# Altium project GoldFinger.PrjPcb
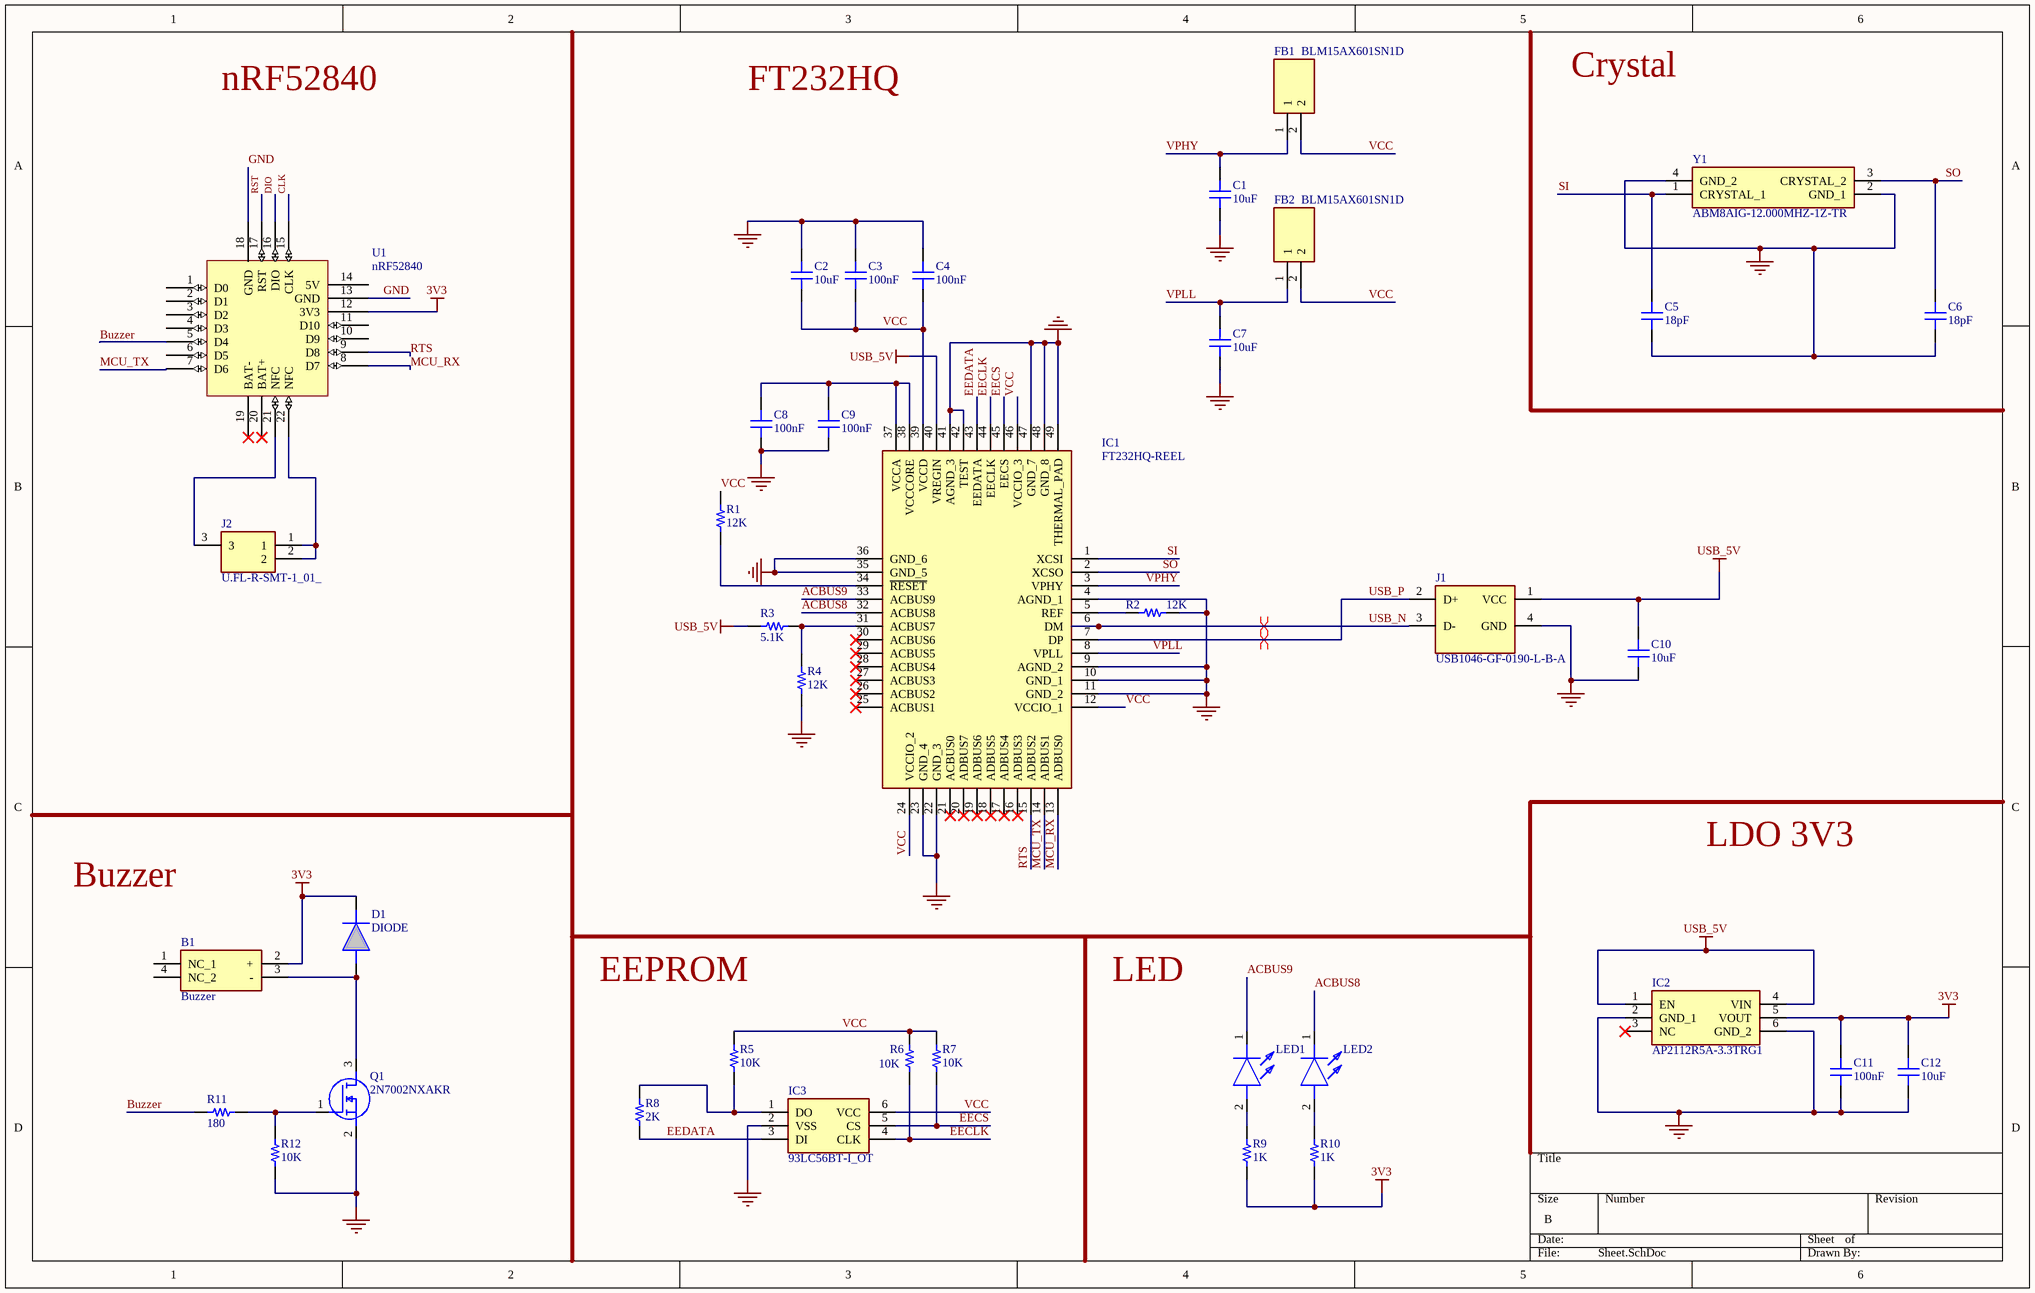
[diagram p0: Sheet.SchDoc]
1 sheet, 38 parts. Net scope: global (net labels, ports and power ports of the same name join across sheets).
Board file: Main.PcbDoc

## Sheet Sheet.SchDoc
size B; SheetNumber: 1; SheetTotal: 1

### Parts
B1  Buzzer  [CMT8530SSMTTR]
C1  10uF  [CAP 0402_1005]
C2  10uF  [CAP 0402_1005]
C3  100nF  [CAP 0402_1005]
C4  100nF  [CAP 0402_1005]
C5  18pF  [CAP 0402_1005]
C6  18pF  [CAP 0402_1005]
C7  10uF  [CAP 0402_1005]
C8  100nF  [CAP 0402_1005]
C9  100nF  [CAP 0402_1005]
C10  10uF  [CAP 0402_1005]
C11  100nF  [CAP 0402_1005]
C12  10uF  [CAP 0402_1005]
D1  DIODE  [SODFL1608X65N]
FB1  BLM15AX601SN1D  [NFZ15SG152SN10B]
FB2  BLM15AX601SN1D  [NFZ15SG152SN10B]
IC1  FT232HQ-REEL  [QFN50P800X800X100-49N-D]
IC2  AP2112R5A-3.3TRG1  [AP2112R5A33TRG1]
IC3  93LC56BT-I_OT  [SOT95P270X145-6N]
J1  USB1046-GF-0190-L-B-A  [USB1046GF0190LBA]
J2  U.FL-R-SMT-1_01_  [U.FL-R-SMT(01)]
LED1  150040VS73240  [LEDC1005X50N]  (value not drawn)
LED2  LW_QH8G-Q2OO-3K5L-1  [LEDC1005X40N]  (value not drawn)
Q1  2N7002NXAKR  [SOT95P230X110-3N]
R1  12K  [RES 0402_1005]
R2  12K  [RES 0402_1005]
R3  5.1K  [RES 0402_1005]
R4  12K  [RES 0402_1005]
R5  10K  [RES 0402_1005]
R6  10K  [RES 0402_1005]
R7  10K  [RES 0402_1005]
R8  2K  [RES 0402_1005]
R9  1K  [RES 0402_1005]
R10  1K  [RES 0402_1005]
R11  180  [RES 0402_1005]
R12  10K  [RES 0402_1005]
U1  nRF52840  [XIAO_nRF52840]
Y1  ABM8AIG-12.000MHZ-1Z-TR  [ABM8AIG12000MHZ1ZTR]

### Nets
3V3: B1.2(+) C11.2 C12.2 D1.1(K) IC2.5(VOUT) R9.1 R10.1 U1.12(3V3)
GND: C1.1 C2.2 C3.2 C4.2 C5.1 C6.1 C7.1 C8.1 C9.1 C10.1 C11.1 C12.1 IC1.4(AGND_1) IC1.9(AGND_2) IC1.10(GND_1) IC1.11(GND_2) IC1.22(GND_3) IC1.23(GND_4) IC1.35(GND_5) IC1.36(GND_6) IC1.41(AGND_3) IC1.42(TEST) IC1.47(GND_7) IC1.48(GND_8) IC1.49(THERMAL_PAD) IC2.2(GND_1) IC2.6(GND_2) IC3.2(VSS) J1.4(GND) Q1.2(S) R2.1 R4.1 R12.1 U1.13(GND) U1.18(GND) Y1.2(GND_1) Y1.4(GND_2)
USB_5V: C10.2 IC1.40(VREGIN) IC2.1(EN) IC2.4(VIN) J1.1(VCC) R3.2
ACBUS8: IC1.32(ACBUS8) LED2.1(K)
ACBUS9: IC1.33(ACBUS9) LED1.1(K)
Buzzer: R11.2 U1.5(D4)
CLK: U1.15(CLK)
DIO: U1.16(DIO)
EECLK: IC1.44(EECLK) IC3.4(CLK) R6.1
EECS: IC1.45(EECS) IC3.5(CS) R7.1
EEDATA: IC1.43(EEDATA) IC3.3(DI) R8.1
MCU_RX: IC1.13(ADBUS0) U1.8(D7)
MCU_TX: IC1.14(ADBUS1) U1.7(D6)
RST: U1.17(RST)
RTS: IC1.15(ADBUS2) U1.9(D8)
SI: C5.2 IC1.1(XCSI) Y1.1(CRYSTAL_1)
SO: C6.2 IC1.2(XCSO) Y1.3(CRYSTAL_2)
USB_N: IC1.6(DM) J1.3(D-)
USB_P: IC1.7(DP) J1.2(D+)
VCC: C2.1 C3.1 C4.1 FB1.2 FB2.2 IC1.12(VCCIO_1) IC1.24(VCCIO_2) IC1.39(VCCD) IC1.46(VCCIO_3) IC3.6(VCC) R1.2 R5.2 R6.2 R7.2
VPHY: C1.2 FB1.1 IC1.3(VPHY)
VPLL: C7.2 FB2.1 IC1.8(VPLL)
NetB1_3: B1.3(-) D1.2(A) Q1.3(D)
NetC8_2: C8.2 C9.2 IC1.37(VCCA) IC1.38(VCCCORE)
NetIC1_5: IC1.5(REF) R2.2
NetIC1_31: IC1.31(ACBUS7) R3.1 R4.2
NetIC1_34: IC1.34(~{RESET}) R1.1
NetIC3_1: IC3.1(DO) R5.1 R8.2
NetJ2_1: J2.1 J2.2 U1.22(NFC)
NetJ2_3: J2.3 U1.21(NFC)
NetLED1_2: LED1.2(A) R9.2
NetLED2_2: LED2.2(A) R10.2
NetQ1_1: Q1.1(G) R11.1 R12.2

Not connected (* = marked no-connect by the designer): B1 1(NC_1) 4(NC_2); IC1 16(ADBUS3)* 17(ADBUS4)* 18(ADBUS5)* 19(ADBUS6)* 20(ADBUS7)* 21(ACBUS0)* 25(ACBUS1)* 26(ACBUS2)* 27(ACBUS3)* 28(ACBUS4)* 29(ACBUS5)* 30(ACBUS6)*; IC2 3(NC)*; U1 1(D0) 2(D1) 3(D2) 4(D3) 6(D5) 10(D9) 11(D10) 14(5V) 19(BAT-)* 20(BAT+)*

### Layout directives
differential pair: USB_N, USB_P

### Notes on the sheet
- nRF52840
- FT232HQ
- Crystal
- Buzzer
- LDO 3V3
- EEPROM
- LED

### Library data of the parts
B1 = CMT-8530S-SMT-TR: Speakers & Transducers Buzzer 8.5mm sq 2.73kHz 3.6V SMT; Manufacturer_Name: CUI Devices; Geometry.Height: 3mm; Mouser Part Number: 490-CMT-8530S-SMT-TR; Mouser Price/Stock: https://www.mouser.co.uk/ProductDetail/CUI-Devices/CMT-8530S-SMT-TR/?qs=qCxwlXJ4fnxl6A4lXsnRBQ%3D%3D; Manufacturer_Part_Number: CMT-8530S-SMT-TR; Datasheet Link: https://datasheet.datasheetarchive.com/originals/distributors/DKDS-12/236652.pdf
C1 C2 C7 C10 C12 = Cap 0402: Multilayer Ceramic Capacitors MLCC - SMD/SMT NEW GLOBAL PN KGM05CR51A106MH 10V 10uF X5R 0402 2mm Pitch 20%; VALUE: 10uF; ComponentLink1Description: New link; ComponentLink1URL: https://eu.mouser.com/ProductDetail/KYOCERA-AVX/CM05X5R106M10AH?qs=MyNHzdoqoQKSCgSEDR5Ylg%3D%3D
C3 C4 C8 C9 C11 = Cap 0402: Multilayer Ceramic Capacitors MLCC - SMD/SMT 0402 16VDC 100nF 10% X7R; VALUE: 100nF; ComponentLink1Description: New link; ComponentLink1URL: https://eu.mouser.com/ProductDetail/TDK/C1005X7R1C104K050BC?qs=NRhsANhppD%252BhAGOapA8QKQ%3D%3D
C5 C6 = Cap 0402: Multilayer Ceramic Capacitors MLCC - SMD/SMT 16V 18pF X8R 0402 2% AEC-Q200; VALUE: 18pF; ComponentLink1Description: New link; ComponentLink1URL: https://eu.mouser.com/ProductDetail/KEMET/C0402C180G4HACAUTO?qs=j%252B1pi9TdxUYvGKJw1Hletg%3D%3D
D1 = BAS716_115: Rectifiers DIODE LOW LEAKAGE TAPE-7; Manufacturer_Name: Nexperia; Manufacturer_Part_Number: BAS716,115; Geometry.Height: 0.65mm; Mouser Part Number: 771-BAS716-T/R; Mouser Price/Stock: https://www.mouser.co.uk/ProductDetail/Nexperia/BAS716115?qs=me8TqzrmIYUJEW4Ty445kw%3D%3D; Datasheet Link: https://assets.nexperia.com/documents/data-sheet/BAS716.pdf
FB1 FB2 = BLM15AX601SN1D: Ferrite Bead; Manufacturer_Name: Murata Electronics; Datasheet Link: http://www.murata.com/~/media/webrenewal/support/library/catalog/products/emc/emifil/c31e.ashx?la=en-gb; Height: 0.55mm; Manufacturer_Part_Number: BLM15AX601SN1D; Mouser Part Number: 81-BLM15AX601SN1D; Mouser Price/Stock: https://www.mouser.co.uk/ProductDetail/Murata-Electronics/BLM15AX601SN1D?qs=MY6wChARw2zrjX4xpWbUQA%3D%3D; Arrow Part Number: BLM15AX601SN1D; Arrow Price/Stock: https://www.arrow.com/en/products/blm15ax601sn1d/murata-manufacturing?region=europe; ComponentLink1Description: New link; ComponentLink1URL: https://eu.mouser.com/ProductDetail/Murata-Electronics/BLM15AX601SN1D?qs=MY6wChARw2zrjX4xpWbUQA%3D%3D
IC1 = FT232HQ-REEL: Integrated Circuit; Manufacturer_Name: FTDI Chip; Datasheet Link: http://www.ftdichip.com/Support/Documents/DataSheets/ICs/DS_FT232H.pdf; Height: 1mm; Manufacturer_Part_Number: FT232HQ-REEL; Mouser Part Number: 895-FT232HQ-REEL; Mouser Price/Stock: https://www.mouser.co.uk/ProductDetail/FTDI/FT232HQ-REEL?qs=rzPzygjq8vI7%2FlAoU8Mqdw%3D%3D; Arrow Part Number: FT232HQ-REEL; Arrow Price/Stock: https://www.arrow.com/en/products/ft232hq-reel/ftdi-chip?region=nac
IC2 = AP2112R5A-3.3TRG1: Integrated Circuit; Manufacturer_Name: Diodes Incorporated; Datasheet Link: https://www.diodes.com/assets/Datasheets/AP2112.pdf; Height: 1.6mm; Manufacturer_Part_Number: AP2112R5A-3.3TRG1; Mouser Part Number: 621-AP2112R5A-3.3TRG; Mouser Price/Stock: https://www.mouser.co.uk/ProductDetail/Diodes-Incorporated/AP2112R5A-3.3TRG1?qs=5V6w%252Be2aIqZ7ofXTuvKxSQ%3D%3D
IC3 = 93LC56BT-I_OT: Integrated Circuit; Manufacturer_Name: Microchip; Manufacturer_Part_Number: 93LC56BT-I/OT; Datasheet Link: http://ww1.microchip.com/downloads/en/DeviceDoc/21794G.pdf; Height: 1.45mm; Mouser Part Number: 579-93LC56BT-I/OT; Mouser Price/Stock: https://www.mouser.co.uk/ProductDetail/Microchip-Technology/93LC56BT-I-OT?qs=lQv0JY93vrc7B5Rh5LPW8g%3D%3D; Arrow Part Number: 93LC56BT-I/OT; Arrow Price/Stock: https://www.arrow.com/en/products/93lc56bt-iot/microchip-technology?region=nac
J1 = USB1046-GF-0190-L-B-A: Connector; Manufacturer_Name: GCT (GLOBAL CONNECTOR TECHNOLOGY); Datasheet Link: https://gct.co/files/drawings/usb1046.pdf?v=ccb5d20d-0631-4297-aa3c-9c34fccf9fbc; Height: 7.2mm; Manufacturer_Part_Number: USB1046-GF-0190-L-B-A; Mouser Part Number: 640-USB1046GF0190LBA; Mouser Price/Stock: https://www.mouser.co.uk/ProductDetail/GCT/USB1046-GF-0190-L-B-A?qs=KUoIvG%2F9IlbZOJtEsn1unA%3D%3D
J2 = U.FL-R-SMT-1_01_: Connector; Manufacturer_Name: Hirose; Manufacturer_Part_Number: U.FL-R-SMT-1(01); Datasheet Link: https://datasheet.datasheetarchive.com/originals/distributors/SFDatasheet-1/sf-00023454.pdf; Mouser Part Number: 798-UFLRSMT101; Mouser Price/Stock: https://www.mouser.co.uk/ProductDetail/Hirose-Connector/U.FL-R-SMT-101?qs=PABxe4V6HDpNsmXV6XKIVg%3D%3D; Arrow Part Number: U.FL-R-SMT-1(01); Arrow Price/Stock: https://www.arrow.com/en/products/u.fl-r-smt-1-01/hirose-electric; Antenna Link: https://www.seeedstudio.com/NFC-Antenna-p-1805.html
LED1 = 150040VS73240: LED; Manufacturer_Name: Wurth Elektronik; Datasheet Link: https://katalog.we-online.de/led/datasheet/150040VS73240.pdf; Height: 0.5mm; Manufacturer_Part_Number: 150040VS73240; Mouser Part Number: 710-150040VS73240; Mouser Price/Stock: https://www.mouser.co.uk/ProductDetail/Wurth-Elektronik/150040VS73240?qs=8Aam6%252B7C6HEhyesRm%252BQyFQ%3D%3D; ComponentLink1Description: New link; ComponentLink1URL: https://eu.mouser.com/ProductDetail/Wurth-Elektronik/150040VS73240?qs=8Aam6%252B7C6HEhyesRm%252BQyFQ%3D%3D
LED2 = LW_QH8G-Q2OO-3K5L-1: LED; Manufacturer_Name: OSRAM; Manufacturer_Part_Number: LW QH8G-Q2OO-3K5L-1; Datasheet Link: https://datasheet.datasheetarchive.com/originals/distributors/DKDS41/DSANUWW0036552.pdf; Height: 0.4mm; Mouser Part Number: 720-LWQH8G-Q2S2-3K5L; Mouser Price/Stock: https://www.mouser.co.uk/ProductDetail/OSRAM-Opto-Semiconductors/LW-QH8G-Q2OO-3K5L-1?qs=74fRo9GAWsx4kLMtacmiJQ%3D%3D; Arrow Part Number: LW QH8G-Q2OO-3K5L-1; Arrow Price/Stock: https://www.arrow.com/en/products/lwqh8g-q2oo-3k5l-1/osram-opto-semiconductors; ComponentLink1Description: New link; ComponentLink1URL: https://eu.mouser.com/ProductDetail/ams-OSRAM/LW-QH8G-Q2OO-3K5L-1?qs=74fRo9GAWsx4kLMtacmiJQ%3D%3D
Q1 = 2N7002NXAKR: MOSFET (N-Channel); Manufacturer_Name: Nexperia; Datasheet Link: https://assets.nexperia.com/documents/data-sheet/2N7002NXAK.pdf; Height: 1.1mm; Manufacturer_Part_Number: 2N7002NXAKR; Mouser Part Number: 771-2N7002NXAKR; Mouser Price/Stock: https://www.mouser.co.uk/ProductDetail/Nexperia/2N7002NXAKR?qs=%252B6g0mu59x7JoAsZYPFXqhw%3D%3D; Arrow Part Number: 2N7002NXAKR; Arrow Price/Stock: https://www.arrow.com/en/products/2n7002nxakr/nexperia?region=europe; ComponentLink1Description: New link; ComponentLink1URL: https://eu.mouser.com/ProductDetail/Nexperia/2N7002NXAKR?qs=%252B6g0mu59x7JoAsZYPFXqhw%3D%3D
R1 R2 R4 = Res 0402: Thin Film Resistors - SMD 12kOhm,0402,1%,50ppm ,63mW,50V; VALUE: 12K; ComponentLink1Description: New link; ComponentLink1URL: https://eu.mouser.com/ProductDetail/KOA-Speer/RN73H1ETTP1202F50?qs=9tvNVxbbcEoiTActxcuNwQ%3D%3D
R3 = Res 0402: Thin Film Resistors - SMD 5.1K OHM 1% 50PPM 1/16W; VALUE: 5.1K; ComponentLink1Description: New link; ComponentLink1URL: https://eu.mouser.com/ProductDetail/YAGEO/RT0402FRE075K1L?qs=gY0y7AQI9SP4FZkrbB0g%252BA%3D%3D
R5-R7 R11 R12 = Res 0402: Thin Film Resistors - SMD 0402 10kOhms 1 % 50P PM 62.5mW AECQ200; ComponentLink1Description: New link
  R5-R7 R12: VALUE: 10K; ComponentLink1URL: https://eu.mouser.com/ProductDetail/YAGEO/AT0402FRE0710KL?qs=vJF2aRtctcDtRwXKNC56yw%3D%3D
  R11: VALUE: 180; ComponentLink1URL: https://eu.mouser.com/ProductDetail/YAGEO/RT0402FRE07180RL?qs=gY0y7AQI9SMchP6eHg8a2Q%3D%3D
R8 = Res 0402: Thin Film Resistors - SMD 0402 2.0Kohm .5% AEC-Q200; VALUE: 2K; ComponentLink1Description: New link; ComponentLink1URL: https://eu.mouser.com/ProductDetail/Panasonic/ERA-2AED202X?qs=nho8PGNfA6q9QhdQjXIGFg%3D%3D
R9 R10 = Res 0402: Thin Film Resistors - SMD 1K ohm 1% 1/16W; VALUE: 1K; ComponentLink1Description: New link; ComponentLink1URL: https://eu.mouser.com/ProductDetail/YAGEO/RT0402FRE071KL?qs=BXCcY9r%252B08AJmLKodK5LLA%3D%3D
U1 = XIAO nRF52840
Y1 = ABM8AIG-12.000MHZ-1Z-TR: Crystals AEC-Q200 CRYSTAL 12.000MHZ 18PF SMD; Manufacturer_Name: ABRACON; Datasheet Link: https://abracon.com/AIGcrystals/ABM8AIG.pdf; Height: 0.8mm; Manufacturer_Part_Number: ABM8AIG-12.000MHZ-1Z-TR; Mouser Part Number: 815-M8AIG-12-1ZT; Mouser Price/Stock: https://www.mouser.co.uk/ProductDetail/ABRACON/ABM8AIG-12.000MHZ-1Z-TR?qs=t7xnP681wgVIFBgGyVZCbw%3D%3D; ComponentLink1Description: New link; ComponentLink1URL: https://eu.mouser.com/ProductDetail/ABRACON/ABM8AIG-12.000MHZ-1Z-T?qs=uwxL4vQweFO5XCxMHCFfeA%3D%3D